# Altium project SPEC_A7.PrjPcb (part 4 of 7)

## Sheet USB_Serial_Quad.SchDoc: SPEC-A7
size 420 x 297 mm; Author: G.Kasprowicz; CompanyName: WUT ISE; DrawnBy: G.Kasprowicz; Organization: WUT ISE; Address1: PW ISE; Address2: Nowowiejska 15/19 00-665 Warsaw; Address3: gkasprow@gmail.com; Revision: 2; SheetNumber: 15; SheetTotal: 18; ModifiedBy: -; CheckedDate: -; Title2: USB IFC; DivGrp: WUT ISE; Designer: G.Kasprowicz; ModifiedDate: -; ProjectName: Sensor Box
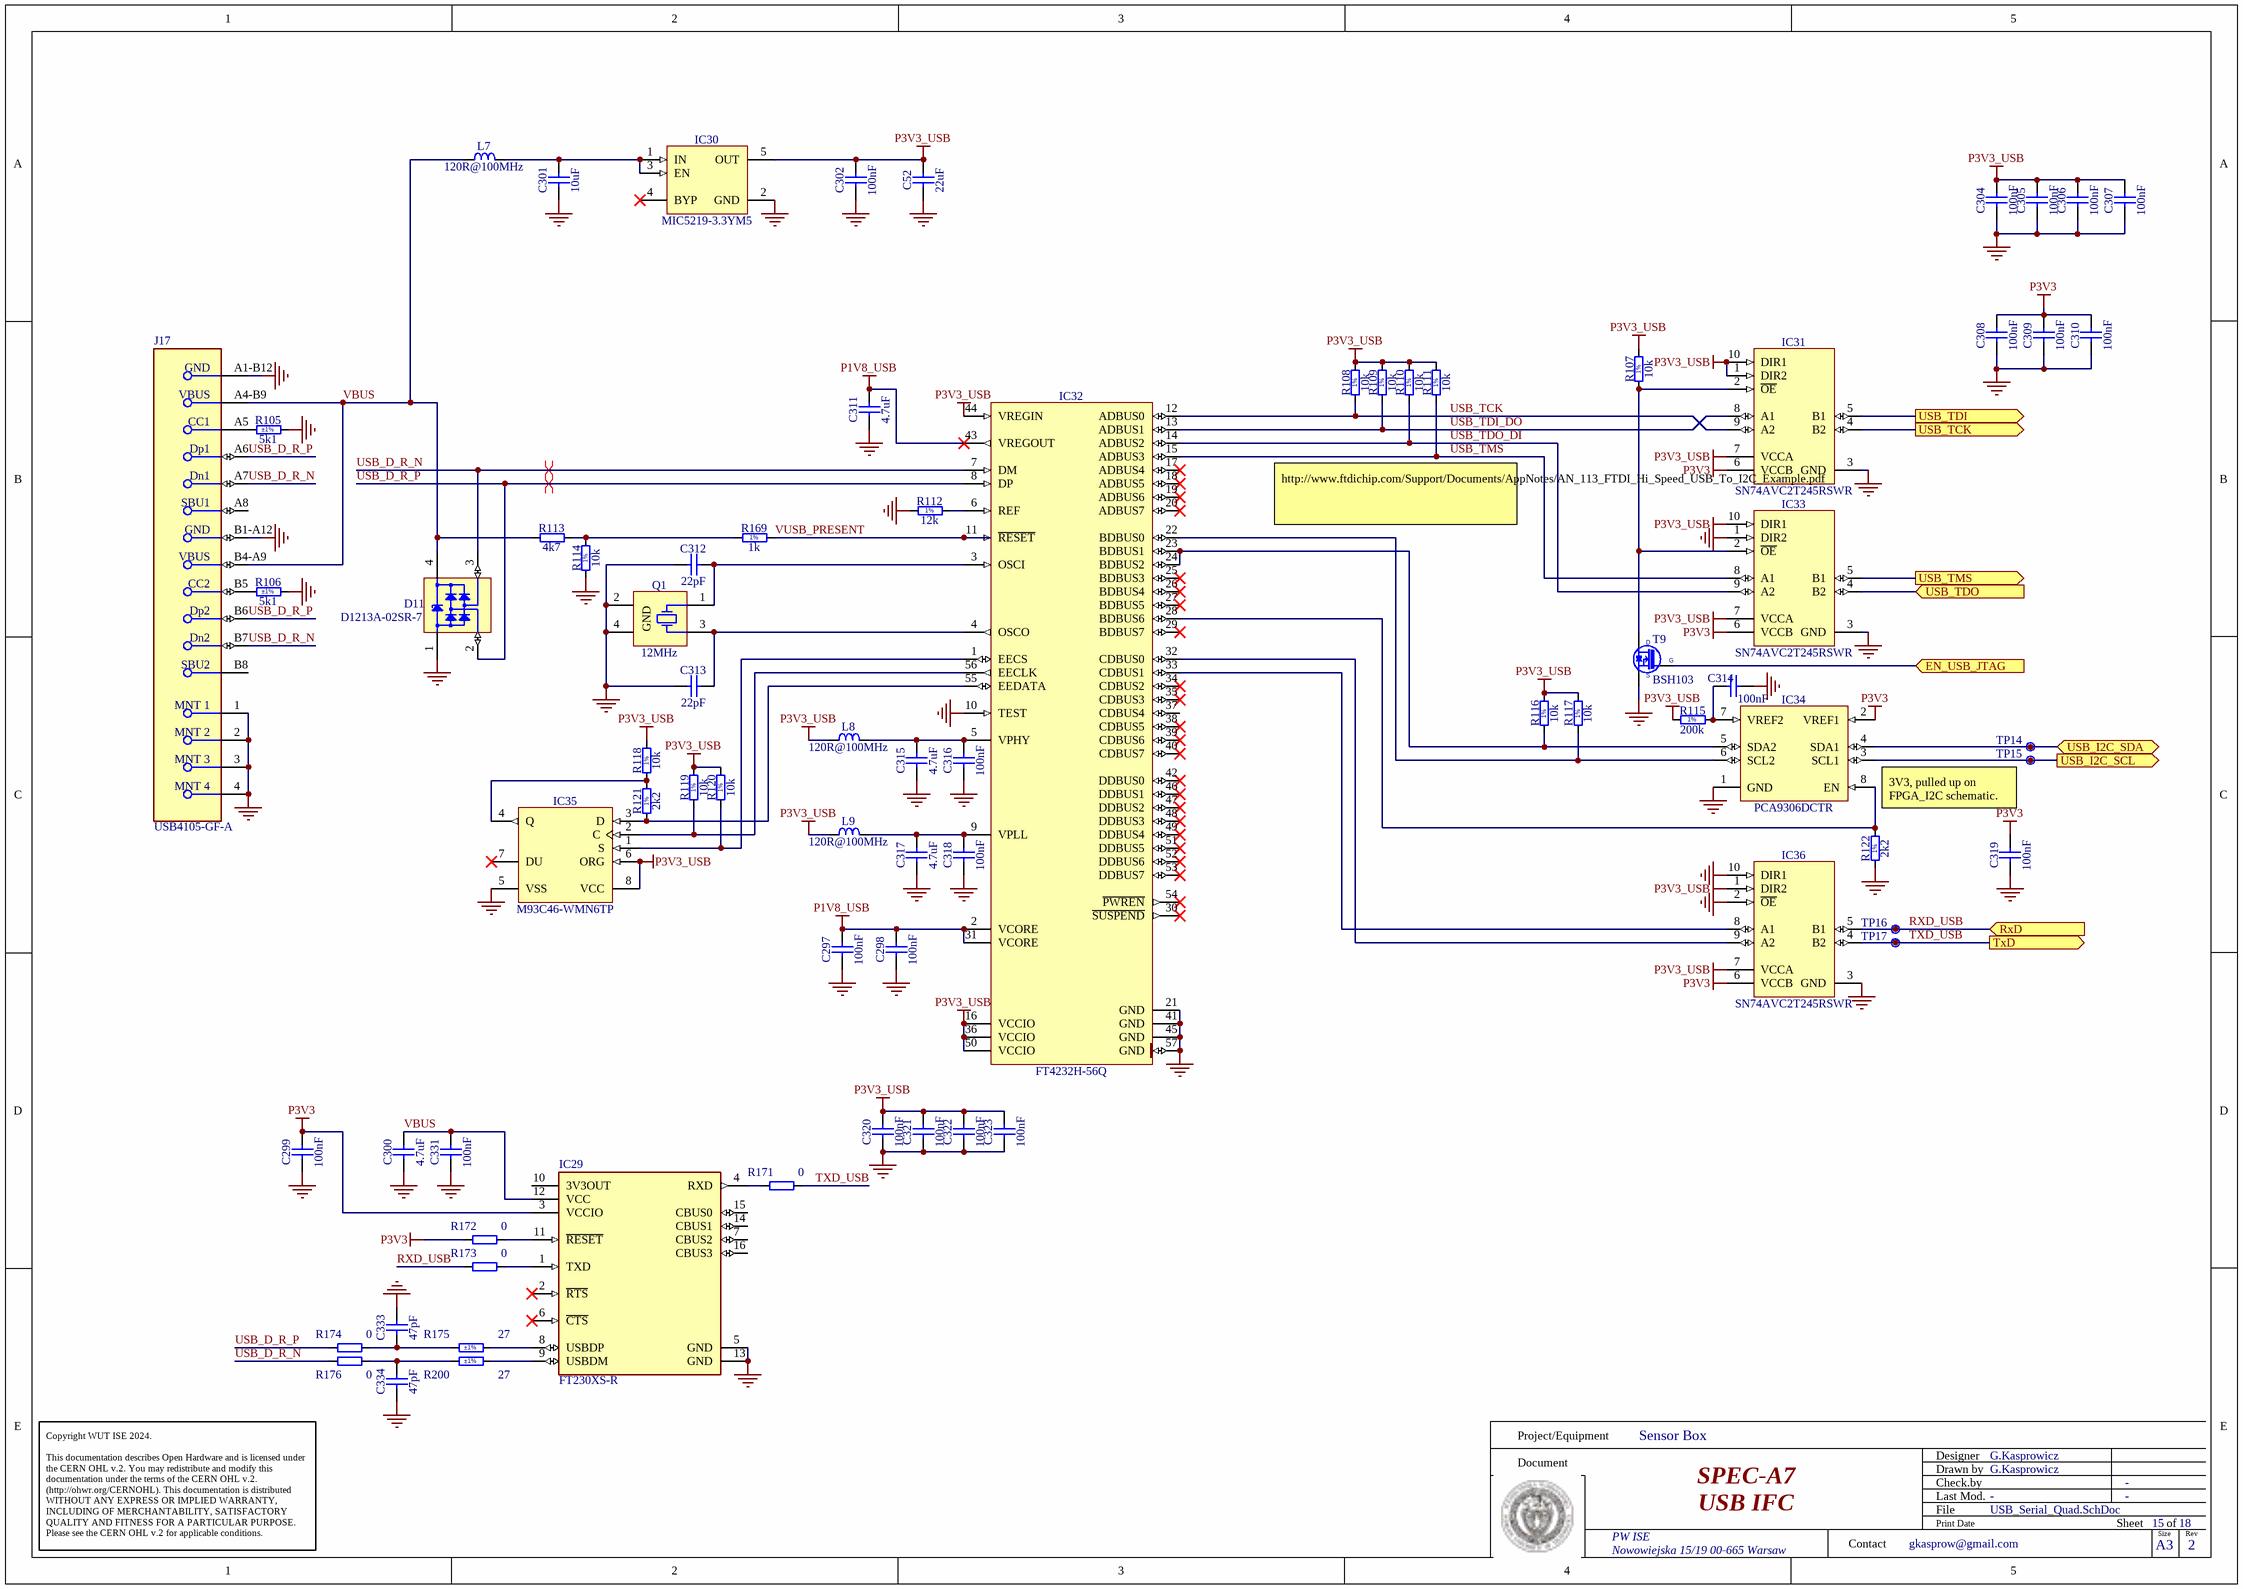
[diagram p8: USB_Serial_Quad.SchDoc]

### Parts
C52  22uF  [CAPC2012X135N]
C297  100nF  [CAPC0603X33N]
C298  100nF  [CAPC0603X33N]
C299  100nF  [CAPC0603X33N]
C300  4.7uF  [CAPC1005X55N]
C301  10uF  [CAPC1608X80N]
C302  100nF  [CAPC0603X33N]
C304  100nF  [CAPC0603X33N]
C305  100nF  [CAPC0603X33N]
C306  100nF  [CAPC0603X33N]
C307  100nF  [CAPC0603X33N]
C308  100nF  [CAPC0603X33N]
C309  100nF  [CAPC0603X33N]
C310  100nF  [CAPC0603X33N]
C311  4.7uF  [CAPC1005X55N]
C312  22pF  [CAPC1005X55N]
C313  22pF  [CAPC1005X55N]
C314  100nF  [CAPC0603X33N]
C315  4.7uF  [CAPC1005X55N]
C316  100nF  [CAPC0603X33N]
C317  4.7uF  [CAPC1005X55N]
C318  100nF  [CAPC0603X33N]
C319  100nF  [CAPC0603X33N]
C320  100nF  [CAPC0603X33N]
C321  100nF  [CAPC0603X33N]
C322  100nF  [CAPC0603X33N]
C323  100nF  [CAPC0603X33N]
C331  100nF  [CAPC0603X33N]
C333  47pF  [CAPC1005X55N]
C334  47pF  [CAPC1005X55N]
D11  D1213A-02SR-7  [SOT190P238X100-4N]
IC29  FT230XS-R  [FP-SSOP-16-MFG]
IC30  MIC5219-3.3YM5  [SOT95P280X145-5N]
IC31  SN74AVC2T245RSWR  [QFN40P140X180X55-10N]
IC32  FT4232H-56Q  [QFN50P800X800X100-57N-S620]
IC33  SN74AVC2T245RSWR  [QFN40P140X180X55-10N]
IC34  PCA9306DCTR  [SOP65P400X130-8N]
IC35  M93C46-WMN6TP  [SOIC127P600X175-8N]
IC36  SN74AVC2T245RSWR  [QFN40P140X180X55-10N]
J17  USB4105-GF-A  [FP-USB4105-GF-A-MFG]
L7  120R@100MHz  [INDC1608X65N]
L8  120R@100MHz  [INDC1608X65N]
L9  120R@100MHz  [INDC1608X65N]
Q1  12MHz  [XTAL_TXC_7M]
R105  5k1  Tolerance: ±1%  [RESC1005X40N]
R106  5k1  Tolerance: ±1%  [RESC1005X40N]
R107  10k  [RESC1005X40N]
R108  10k  [RESC1005X40N]
R109  10k  [RESC1005X40N]
R110  10k  [RESC1005X40N]
R111  10k  [RESC1005X40N]
R112  12k  [RESC1005X40N]
R113  4k7  [RESC1005X40N]
R114  10k  [RESC1005X40N]
R115  200k  [RESC1005X40N]
R116  10k  [RESC1005X40N]
R117  10k  [RESC1005X40N]
R118  10k  [RESC1005X40N]
R119  10k  [RESC1005X40N]
R120  10k  [RESC1005X40N]
R121  2k2  [RESC1005X40N]
R122  2k2  [RESC1005X40N]
R169  1k  [RESC1005X40N]
R171  0  [RESC1005X40N]
R172  0  [RESC1005X40N]
R173  0  [RESC1005X40N]
R174  0  [RESC1005X40N]
R175  27  Tolerance: ±1%  [RESC1005X40N]
R176  0  [RESC1005X40N]
R200  27  Tolerance: ±1%  [RESC1005X40N]
T9  BSH103  [SOT95P230X110-3N]
TP14  Test Point  [TPS127]  (value not drawn)  (no BOM)
TP15  Test Point  [TPS127]  (value not drawn)  (no BOM)
TP16  Test Point  [TPS127]  (value not drawn)  (no BOM)
TP17  Test Point  [TPS127]  (value not drawn)  (no BOM)

### Ports
EN_USB_JTAG (in, see SPEC-A7-TOP[2D], FPGA_PWR_CONFIG[2E]), RxD (in, see SPEC-A7-TOP[2D]), TxD (out, see SPEC-A7-TOP[2D]), USB_I2C_SCL (out, see SPEC-A7-TOP[2D]), USB_I2C_SDA (bidir, see SPEC-A7-TOP[2D]), USB_TCK (out, see SPEC-A7-TOP[2D]), USB_TDI (out, see SPEC-A7-TOP[2D]), USB_TDO (in, see SPEC-A7-TOP[2D]), USB_TMS (out, see SPEC-A7-TOP[2D])

### Nets
GND: C52.1 C297.1 C298.1 C299.1 C300.1 C301.1 C302.1 C304.1 C305.1 C306.1 C307.1 C308.1 C309.1 C310.1 C311.1 C312.1 C313.1 C314.2 C315.1 C316.1 C317.1 C318.1 C319.1 C320.1 C321.1 C322.1 C323.1 C331.1 C333.2 C334.1 D11.1(GND) IC29.5(GND) IC29.13(GND) IC30.2(GND) IC31.3(GND) IC32.10(TEST) IC32.21(GND) IC32.41(GND) IC32.45(GND) IC32.57(GND) IC33.1(DIR2) IC33.3(GND) IC34.1(GND) IC35.5(VSS) IC36.2(~{OE}) IC36.3(GND) IC36.10(DIR1) J17.1(MNT_1) J17.2(MNT_2) J17.3(MNT_3) J17.4(MNT_4) J17.A1-B12(GND) J17.B1-A12(GND) Q1.2(GND) Q1.4(GND) R105.2 R106.2 R112.1 R114.1 R122.1 T9.2(S)
P1V8_USB: C297.2 C298.2 C311.2 IC32.2(VCORE) IC32.31(VCORE) IC32.43(VREGOUT)
P3V3: C299.2 C308.2 C309.2 C310.2 C319.2 IC29.3(VCCIO) IC31.6(VCCB) IC33.6(VCCB) IC34.2(VREF1) IC36.6(VCCB) R172.1
P3V3_USB: C52.2 C302.2 C304.2 C305.2 C306.2 C307.2 C320.2 C321.2 C322.2 C323.2 IC30.5(OUT) IC31.1(DIR2) IC31.7(VCCA) IC31.10(DIR1) IC32.16(VCCIO) IC32.36(VCCIO) IC32.44(VREGIN) IC32.50(VCCIO) IC33.7(VCCA) IC33.10(DIR1) IC35.6(ORG) IC35.8(VCC) IC36.1(DIR2) IC36.7(VCCA) L8.1 L9.1 R107.2 R108.2 R109.2 R110.2 R111.2 R115.1 R116.2 R117.2 R118.2 R119.2 R120.2
CFG_TCK: IC31.4(B2) ; port USB_TCK
CFG_TDI: IC31.5(B1) ; port USB_TDI
CFG_TDO: IC33.4(B2) ; port USB_TDO
CFG_TMS: IC33.5(B1) ; port USB_TMS
RXD_USB: IC36.5(B1) R173.1 TP16.1 ; port RxD
TXD_USB: IC36.4(B2) R171.2 TP17.1 ; port TxD
USB_D_R_N: D11.3(I/O2) IC32.7(DM) J17.A7(Dn1) J17.B7(Dn2) R176.1
USB_D_R_P: D11.2(I/O1) IC32.8(DP) J17.A6(Dp1) J17.B6(Dp2) R174.1
USB_TCK: IC31.9(A2) IC32.12(ADBUS0) R108.1
USB_TDI_DO: IC31.8(A1) IC32.13(ADBUS1) R109.1
USB_TDO_DI: IC32.14(ADBUS2) IC33.9(A2) R110.1
USB_TMS: IC32.15(ADBUS3) IC33.8(A1) R111.1
VBUS: C300.2 C331.2 D11.4(VCC) IC29.12(VCC) J17.A4-B9(VBUS) J17.B4-A9(VBUS) L7.1 R113.1
VUSB_PRESENT: IC32.11(~{RESET}) R169.2
NetC134_2: T9.1(G) ; port EN_USB_JTAG
NetC301_2: C301.2 IC30.1(IN) IC30.3(EN) L7.2
NetC312_2: C312.2 IC32.3(OSCI) Q1.1(X)
NetC313_2: C313.2 IC32.4(OSCO) Q1.3(X)
NetC314_1: C314.1 IC34.7(VREF2) R115.2
NetC315_2: C315.2 C316.2 IC32.5(VPHY) L8.2
NetC317_2: C317.2 C318.2 IC32.9(VPLL) L9.2
NetC333_1: C333.1 R174.2 R175.1
NetC334_2: C334.2 R176.2 R200.1
NetIC29_1: IC29.1(TXD) R173.2
NetIC29_4: IC29.4(RXD) R171.1
NetIC29_8: IC29.8(USBDP) R175.2
NetIC29_9: IC29.9(USBDM) R200.2
NetIC29_11: IC29.11(~{RESET}) R172.2
NetIC31_2: IC31.2(~{OE}) IC33.2(~{OE}) R107.1 T9.3(D)
NetIC32_1: IC32.1(EECS) IC35.1(S) R120.1
NetIC32_6: IC32.6(REF) R112.2
NetIC32_22: IC32.22(BDBUS0) IC34.6(SCL2) R117.1
NetIC32_23: IC32.23(BDBUS1) IC32.24(BDBUS2) IC34.5(SDA2) R116.1
NetIC32_28: IC32.28(BDBUS6) IC34.8(EN) R122.2
NetIC32_32: IC32.32(CDBUS0) IC36.9(A2)
NetIC32_33: IC32.33(CDBUS1) IC36.8(A1)
NetIC32_55: IC32.55(EEDATA) IC35.3(D) R121.2
NetIC32_56: IC32.56(EECLK) IC35.2(C) R119.1
NetIC34_3: IC34.3(SCL1) TP15.1 ; port USB_I2C_SCL
NetIC34_4: IC34.4(SDA1) TP14.1 ; port USB_I2C_SDA
NetIC35_4: IC35.4(Q) R118.1 R121.1
NetJ17_A5: J17.A5(CC1) R105.1
NetJ17_B5: J17.B5(CC2) R106.1
NetR113_2: R113.2 R114.2 R169.1

Not connected (* = marked no-connect by the designer): IC29 2(~{RTS})* 6(~{CTS})* 7(CBUS2) 10(3V3OUT) 14(CBUS1) 15(CBUS0) 16(CBUS3); IC30 4(BYP)*; IC32 17(ADBUS4)* 18(ADBUS5)* 19(ADBUS6)* 20(ADBUS7)* 25(BDBUS3)* 26(BDBUS4)* 27(BDBUS5)* 29(BDBUS7)* 30(~{SUSPEND})* 34(CDBUS2)* 35(CDBUS3)* 37(CDBUS4) 38(CDBUS5)* 39(CDBUS6)* 40(CDBUS7)* 42(DDBUS0)* 46(DDBUS1)* 47(DDBUS2)* 48(DDBUS3)* 49(DDBUS4)* 51(DDBUS5)* 52(DDBUS6)* 53(DDBUS7)* 54(~{PWREN})*; IC35 7(DU)*; J17 A8(SBU1) B8(SBU2)

### Layout directives
differential pair; differential pair class Diff_90Ohm: USB_D_R_N, USB_D_R_P

### Notes on the sheet
- http://www.ftdichip.com/Support/Documents/AppNotes/AN_113_FTDI_Hi_Speed_USB_To_I2C_Example.pdf
- 3V3, pulled up on FPGA_I2C schematic.
- Project/Equipment
- Document
- Designer
- Drawn by
- Check.by
- Copyright WUT ISE 2024.
  This documentation describes Open Hardware and is licensed under the CERN OHL v.2. You may redistribute and modify this documentation under the terms of the CERN OHL v.2. (http://ohwr.org/CERNOHL). This documentation is distributed WITHOUT ANY EXPRESS OR IMPLIED WARRANTY, INCLUDING OF MERCHANTABILITY, SATISFACTORY QUALITY AND FITNESS FOR A PARTICULAR PURPOSE. Please see the CERN OHL v.2 for applicable conditions.
- Contact
- File
- Last Mod.
- Print Date
- Sheet
- Size
- A3
- of
- Rev
- (in symbol R0402_1k_1%_0.0625W_100PPM) 1%
- (in symbol R0402_2K2_1%_0.0625W_100PPM) 1%
- (in symbol R0402_10K_1%_0.0625W_100PPM) 1%
- (in symbol R0402_12K_1%_0.0625W_100PPM) 1%
- (in symbol R0402_200K_1%_0.0625W_100PPM) 1%

### Library data of the parts
C52 = CC0805_22UF_16V_10%_X5R: Non-polarised capacitor; Part Description: SMD Multilayer Chip Ceramic Capacitor; Manufacturer: GENERIC; Manufacturer1 Part Number: C2012X5R1C226KT; Voltage: 16V; TC: X5R; Tolerance: ±10%; Part Number: CC0805_22UF_16V_10%_X5R; Component Kind: Standard; Component Type: Standard; Pin Count: 2; Value: 22uF; Status: Preferred; Manufacturer Part Number: CC0805_22UF_16V_10%_X5R; Case: 0805; Mounted: Yes; Socket: No; SMD: Yes; Sense: No; Manufacturer1 Example: TDK; Manufacturer1 ComponentHeight: 1.35mm; HelpURL: \\cern.ch\dfs\Applications\Altium\Datasheets\CC0805_X5R_TDK_C.pdf; Author: CERN DEM JLC; CreateDate: 25.10.2012; LatestRevisionDate: 25.10.2012
C297-C299 C302 C304-C310 C314 C316 C318-C323 C331 = CC0201_100NF_6.3V_10%_X5R: Non-polarised capacitor; Part Description: SMD Multilayer Chip Ceramic Capacitor; Manufacturer: GENERIC; Manufacturer1 Part Number: 02016D104KAT2A; Voltage: 6.3V; TC: X5R; Tolerance: ±10%; Part Number: CC0201_100NF_6.3V_10%_X5R; Component Kind: Standard; Component Type: Standard; Pin Count: 2; Value: 100nF; Status: Not Recommended; Manufacturer Part Number: CC0201_100NF_6.3V_10%_X5R; Case: 0201; Mounted: Yes; Socket: No; SMD: Yes; Sense: No; Manufacturer1 Example: AVX; Manufacturer1 ComponentHeight: 0.33mm; HelpURL: \\cern.ch\dfs\Applications\Altium\Datasheets\CC0201_X5R_AVX.pdf; Author: CERN DEM JLC; CreateDate: 03.12.2007; LatestRevisionDate: 03.12.2007
C300 C311 C315 C317 = CC0402_4.7UF_6.3V_20%_X5R: Non-polarised capacitor; Part Description: SMD Multilayer Chip Ceramic Capacitor; Manufacturer: GENERIC; Manufacturer1 Part Number: C1005X5R0J475M050; Voltage: 6.3V; TC: X5R; Tolerance: ±20%; Part Number: CC0402_4.7UF_6.3V_20%_X5R; Component Kind: Standard; Component Type: Standard; Pin Count: 2; Value: 4.7uF; Status: Preferred; Manufacturer Part Number: CC0402_4.7UF_6.3V_20%_X5R; Case: 0402; Mounted: Yes; Socket: No; SMD: Yes; Sense: No; Manufacturer1 Example: TDK; Manufacturer1 ComponentHeight: 0.65mm; HelpURL: \\cern.ch\dfs\Applications\Altium\Datasheets\CC0402_X5R_TDK_C.pdf; Author: CERN DEM JLC; CreateDate: 03.03.2015; LatestRevisionDate: 03.03.2015
C301 = CC0603_10UF_16V_20%_X5R: Non-polarised capacitor; Part Description: SMD Multilayer Chip Ceramic Capacitor; Manufacturer: GENERIC; Manufacturer1 Part Number: GRM188R61C106MA73D; Voltage: 16V; TC: X5R; Tolerance: ±20%; Part Number: CC0603_10UF_16V_20%_X5R; Component Kind: Standard; Component Type: Standard; Pin Count: 2; Value: 10uF; Status: None; Manufacturer Part Number: CC0603_10UF_16V_20%_X5R; Case: 0603; Mounted: Yes; Socket: No; SMD: Yes; Sense: No; Manufacturer1 Example: MURATA; Manufacturer1 ComponentHeight: 0.8mm; HelpURL: \\cern.ch\dfs\Applications\Altium\Datasheets\CC0603_X5R_MURATA_GRM.pdf; Author: CERN DEM MR; CreateDate: 02.03.2016; LatestRevisionDate: 02.03.2016
C312 C313 = CC0402_22PF_50V_5%_C0G: Non-polarised capacitor; Part Description: SMD Multilayer Chip Ceramic Capacitor; Manufacturer: GENERIC; Manufacturer1 Part Number: C0402C220J5GACTU; Voltage: 50V; TC: C0G/NP0; Tolerance: ±5%; Part Number: CC0402_22PF_50V_5%_C0G; Component Kind: Standard; Component Type: Standard; Pin Count: 2; Value: 22pF; Status: Preferred; Manufacturer Part Number: CC0402_22PF_50V_5%_C0G; Case: 0402; Mounted: Yes; Socket: No; SMD: Yes; Sense: No; Manufacturer1 Example: KEMET; Manufacturer1 ComponentHeight: 0.55mm; HelpURL: \\cern.ch\dfs\Applications\Altium\Datasheets\CC0805_C0G_KEMET_(Commercial Grade).pdf; Author: CERN DEM JLC; CreateDate: 03.12.2007; LatestRevisionDate: 03.12.2007
C333 C334 = CC0402_47PF_50V_5%_C0G: Non-polarised capacitor; Part Description: SMD Multilayer Chip Ceramic Capacitor; Manufacturer: GENERIC; Manufacturer1 Part Number: C0402C470J5GACTU; Voltage: 50V; TC: C0G/NP0; Tolerance: ±5%; Part Number: CC0402_47PF_50V_5%_C0G; Component Kind: Standard; Component Type: Standard; Pin Count: 2; Value: 47pF; Status: Preferred; Manufacturer Part Number: CC0402_47PF_50V_5%_C0G; Case: 0402; Mounted: Yes; Socket: No; SMD: Yes; Sense: No; Manufacturer1 Example: KEMET; Manufacturer1 ComponentHeight: 0.55mm; HelpURL: \\cern.ch\dfs\Applications\Altium\Datasheets\CC0402_C0G_KEMET_(Commercial Grade).pdf; Author: CERN DEM JLC; CreateDate: 03.12.2007; LatestRevisionDate: 22.04.2015
D11 = CMP-004-00039-1: D1213A-02SR Series 400 mW Uni-Directional Surface Mount TVS Diode - SOT-143; Mounting Technology: Surface Mount; Case/Package: SOT-143; Max Operating Temperature: 150°C; Pins: 4; Min Operating Temperature: -65°C
IC29 = CMP-0248-00026-3: IC USB SERIAL BASIC UART 16SSOP; Min Supply Voltage: 2.97V; Data Rate: 12Mbps; Operating Supply Voltage: 5V; Number of Channels: 1; Max Supply Voltage: 5.5V; Operating Supply Current: 8mA; Case/Package: SSOP; Length: 5mm; Interface: UART; Mount: Surface Mount; Number of Pins: 16; Packaging: Tape and Reel; Weight: 0.004586oz; Min Operating Temperature: -40°C; Width: 0.157inch; Height: 0.059inch; Package Quantity: 3000; Max Operating Temperature: 85°C
IC30 = MIC5219-3.3YM5: 500mA Peak Output LDO Regulator; Part Description: 3.3V 500mA Peak Output Low Drop-Out  (LDO) Regulator; Manufacturer: MICROCHIP TECHNOLOGY; PressFit: No; Bonding: No; Part Number: MIC5219-3.3YM5; Component Kind: Standard; Component Type: Standard; Device: MIC5219-3.3YM5; PackageDescription: SOT, 0.95mm pitch; 5 pin, 1.60mm W X 2.90mm L X 1.45mm H body, IPC Medium Density; Manufacturer Part Number: MIC5219-3.3YM5; Pin Count: 5; Case: SOT23-5; Mounted: Yes; Socket: No; SMD: Yes; Sense: No; ComponentHeight: 1.45mm; HelpURL: \\cern.ch\dfs\Applications\Altium\Datasheets\MIC5219-3.3YM5.pdf; Author: CERN DEM WB; CreateDate: 2019-04-16; LatestRevisionDate: 2019-04-16
IC31 IC33 IC36 = SN74AVC2T245RSWR: Dual-Bit Dual-Supply Bus Transceiver With Configurable Voltage Translation and 3-State Outputs; Manufacturer: TEXAS INSTRUMENTS; PressFit: No; Bonding: No; Part Number: SN74AVC2T245RSWR; Component Kind: Standard; Component Type: Standard; Device: SN74AVC2T245RSWR; PackageDescription: QFN, 0.40mm Pitch, Rect.;10 Pin, 1.80mm L X 1.40mm W X 0.55mm H Body, IPC Medium Density; Status: Not Recommended; Part Description: Dual-Bit Dual-Supply Bus Transceiver With Configurable Voltage Translation and 3-State Outputs; Manufacturer Part Number: SN74AVC2T245RSWR; Pin Count: 10; Case: QFN10; Mounted: Yes; Socket: No; SMD: Yes; Sense: No; ComponentHeight: 0.55mm; Author: CERN DEM JLC; HelpURL: \\cern.ch\dfs\Applications\Altium\Datasheets\SN74AVC2T245RSWR.pdf; CreateDate: 07.07.2014; LatestRevisionDate: 30.03.2017
IC32 = FT4232H-56Q: Quad High Speed USB to Multipurpose UART/MPSSE IC; Manufacturer: FUTURE TECHNOLOGY DEVICES INTERNATIONAL (FTDI); PressFit: No; Bonding: No; Part Number: FT4232H-56Q; Component Kind: Standard; Component Type: Standard; Device: FT4232H-56Q; PackageDescription: QFN, 0.50mm Pitch, Square; 56 Pin, 8.00mm L X 8.00mm W X 1.00mm H body (6.1mm X 6.1mm Thermal tab), IPC Medium Density; Part Description: Quad High Speed USB to Multipurpose UART/MPSSE IC; Manufacturer Part Number: FT4232H-56Q; Pin Count: 57; Case: QFN56; Mounted: Yes; Socket: No; SMD: Yes; Sense: No; ComponentHeight: 1mm; Author: CERN DEM JLC; HelpURL: \\cern.ch\dfs\Applications\Altium\Datasheets\FT4232H-56Q.pdf; CreateDate: 11.10.2016; LatestRevisionDate: 11.10.2016
IC34 = PCA9306DCTR: Dual Bidirectional I2C Bus And SMBus Voltage-Level Translator; Manufacturer: TEXAS INSTRUMENTS; PressFit: No; Bonding: No; Part Number: PCA9306DCTR; Component Kind: Standard; Component Type: Standard; Device: PCA9306DCTR; PackageDescription: SOP, 0.65mm, Pitch; 8 Pin, 2.80mm W X 2.95mm L X 1.30mm H Body, PC Medium Density; Part Description: Dual Bidirectional I2C Bus And SMBus Voltage-Level Translator; Manufacturer Part Number: PCA9306DCTR; Pin Count: 8; Case: SSOP8; Mounted: Yes; Socket: No; SMD: Yes; Sense: No; ComponentHeight: 1.3mm; Author: CERN DEM JLC; HelpURL: \\cern.ch\dfs\Applications\Altium\Datasheets\PCA9306DCTR.pdf; CreateDate: 25.02.2013; LatestRevisionDate: 11.02.2016
IC35 = M93C46-WMN6TP: 2.5 to 5.5 V, 1Kb (128x8) Serial Microwire Bus EEPROM; Part Description: 1Kbit (128 x 8 bit or 64 x 16 bit) MICROWIRE® Serial Access EEPROM; Manufacturer: ST MICROELECTRONICS; PressFit: No; Bonding: No; Part Number: M93C46-WMN6TP; Component Kind: Standard; Component Type: Standard; Device: M93C46-WMN6TP; PackageDescription: SOIC 8, Pitch 1.27mm - Body 4x5mm, IPC Medium Density; Manufacturer Part Number: M93C46-WMN6TP; Pin Count: 8; Case: SOIC8; Mounted: Yes; Socket: No; SMD: Yes; Sense: No; ComponentHeight: 1.75mm; HelpURL: \\cern.ch\dfs\Applications\Altium\Datasheets\M93C46-WMN6TP.pdf; Author: CERN DEM JLC; CreateDate: 15.11.2012; LatestRevisionDate: 15.11.2012
J17 = CMP-245163-000001-1: CONN RCPT USB2.0 TYPEC 5A; Manufacturer: GCT; Voltage Rating: 20V; Is Female: yes; Current Rating: 5/6.25/1.25/0.25A; Number Of Contacts: 16; Conn Orientation: Right Angle; Device Class L1: Connectors; Category: Conn; Lead Free: Yes; RoHS: TRUE; Temperature Range High: +85°C; Digikey Description: CONN RCPT USB2.0 TYPEC 5A; Device Class L3: unset; ComponentLink2Description: Datasheet; Manufacturer Part Number: USB4105-GF-A; Package: 0; Usb Standard: USB 2.0; Device Class L2: USB Connectors; Automotive: No; Temperature Range Low: -40°C; Height: 3.46mm; Temperature: -40°C to +85°C; Contact Material: Gold,Nickel; ComponentLink2URL: https://gct.co/files/drawings/usb4105.pdf; Octopart: https://octopart.com/usb4105-gf-a-gct-106627878
L7-L9 = IND0603_MURATA_BLM18SG121TN1D: Inductor; Part Description: SMD EMIFIL Suppression Chip Ferrite Bead; Manufacturer: MURATA; Power: 3A; Resistance: 0.025R; Tolerance: ±25%; Part Number: IND0603_MURATA_BLM18SG121TN1D; Component Kind: Standard; Component Type: Standard; Pin Count: 2; Value: 120R@100MHz; Status: None; Manufacturer Part Number: BLM18SG121TN1D; Case: 0603; Mounted: Yes; Socket: No; SMD: Yes; Sense: No; ComponentHeight: 0.65mm; HelpURL: \\cern.ch\dfs\Applications\Altium\Datasheets\IND0603_MURATA_BLM18S.pdf; Author: CERN DEM JLC; CreateDate: 23.07.2014; LatestRevisionDate: 23.07.2014
Q1 = XTAL_12MHZ_TXC_7M-12.000MAAJ-T: Crystal 4 pins 1=XTAL Control 2=GND3=XTAL 4=GND; Part Description: ±30ppm 18pF -20°C to +70°C  4 Pins, 3.2x2.5X0.8mm, SMD Sealing Crystal, 7M Series; Manufacturer: TXC CORPORATION; PressFit: No; Bonding: No; Part Number: XTAL_12MHZ_TXC_7M-12.000MAAJ-T; Component Kind: Standard; Component Type: Standard; PackageDescription: 4 Pins, 2.5x3.2mm, SMD Sealing Crystal, 7M Serie; Value: 12MHz; Manufacturer Part Number: 7M-12.000MAAJ-T; Pin Count: 4; Mounted: Yes; Socket: No; SMD: Yes; Sense: No; ComponentHeight: 0.8mm; HelpURL: \\cern.ch\dfs\Applications\Altium\Datasheets\XTAL_TXC_7M.pdf; Author: CERN DEM JLC; CreateDate: 19.06.2012; LatestRevisionDate: 19.06.2012
R105 R106 = R0402_5K1_1%_0.0625W_100PPM: Resistor - 1%; Part Description: General Purpose Thick Film Chip Resistor; Manufacturer: GENERIC; Manufacturer1 Part Number: 232270675102L; TC: ±100ppm/°C; PressFit: No; Part Number: R0402_5K1_1%_0.0625W_100PPM; Component Kind: Standard; Component Type: Standard; Pin Count: 2; Value: 5k1; Status: Not Recommended; Power: 0.0625W; Manufacturer Part Number: R0402_5K1_1%_0.0625W_100PPM; Case: 0402; Mounted: Yes; Sense: No; Socket: No; SMD: Yes; Manufacturer1 Example: YAGEO PHYCOMP; Manufacturer1 ComponentHeight: 0.4mm; HelpURL: \\cern.ch\dfs\Applications\Altium\Datasheets\R0402_Phycomp_RC0402.pdf; Author: CERN DEM JLC; CreateDate: 03.12.2007; LatestRevisionDate: 17.10.2012
R107-R111 R114 R116-R120 = R0402_10K_1%_0.0625W_100PPM: Resistor - 1%; Part Description: General Purpose Thick Film Chip Resistor; Manufacturer: GENERIC; Manufacturer1 Part Number: 232270671003L; TC: ±100ppm/°C; PressFit: No; Part Number: R0402_10K_1%_0.0625W_100PPM; Component Kind: Standard; Component Type: Standard; Pin Count: 2; Value: 10k; Status: Not Recommended; Power: 0.0625W; Tolerance: ±1%; Manufacturer Part Number: R0402_10K_1%_0.0625W_100PPM; Case: 0402; Mounted: Yes; Socket: No; SMD: Yes; Manufacturer1 Example: YAGEO PHYCOMP; Manufacturer1 ComponentHeight: 0.4mm; HelpURL: \\cern.ch\dfs\Applications\Altium\Datasheets\R0402_Phycomp_RC0402.pdf; Author: CERN DEM JLC; CreateDate: 03.12.2007; LatestRevisionDate: 17.10.2012; Sense: No
R112 = R0402_12K_1%_0.0625W_100PPM: Resistor - 1%; Part Description: General Purpose Thick Film Chip Resistor; Manufacturer: GENERIC; Manufacturer1 Part Number: 232270671203L; TC: ±100ppm/°C; PressFit: No; Part Number: R0402_12K_1%_0.0625W_100PPM; Component Kind: Standard; Component Type: Standard; Pin Count: 2; Value: 12k; Status: Not Recommended; Power: 0.0625W; Tolerance: ±1%; Manufacturer Part Number: R0402_12K_1%_0.0625W_100PPM; Case: 0402; Mounted: Yes; Sense: No; Socket: No; SMD: Yes; Manufacturer1 Example: YAGEO PHYCOMP; Manufacturer1 ComponentHeight: 0.4mm; HelpURL: \\cern.ch\dfs\Applications\Altium\Datasheets\R0402_Phycomp_RC0402.pdf; Author: CERN DEM JLC; CreateDate: 03.12.2007; LatestRevisionDate: 17.10.2012
R113 = R0402_4K7_1%_0.0625W_100PPM: Resistor - 1%; Part Description: General Purpose Thick Film Chip Resistor; Manufacturer: GENERIC; Manufacturer1 Part Number: 232270674702L; TC: ±100ppm/°C; PressFit: No; Part Number: R0402_4K7_1%_0.0625W_100PPM; Component Kind: Standard; Component Type: Standard; Pin Count: 2; Value: 4k7; Status: Not Recommended; Power: 0.0625W; Tolerance: ±1%; Manufacturer Part Number: R0402_4K7_1%_0.0625W_100PPM; Case: 0402; Mounted: Yes; Sense: No; Socket: No; SMD: Yes; Manufacturer1 Example: YAGEO PHYCOMP; Manufacturer1 ComponentHeight: 0.4mm; HelpURL: \\cern.ch\dfs\Applications\Altium\Datasheets\R0402_Phycomp_RC0402.pdf; Author: CERN DEM JLC; CreateDate: 03.12.2007; LatestRevisionDate: 17.10.2012
R115 = R0402_200K_1%_0.0625W_100PPM: Resistor - 1%; Part Description: General Purpose Thick Film Chip Resistor; Manufacturer: GENERIC; Manufacturer1 Part Number: 232270672004L; TC: ±100ppm/°C; PressFit: No; Part Number: R0402_200K_1%_0.0625W_100PPM; Component Kind: Standard; Component Type: Standard; Pin Count: 2; Value: 200k; Status: Not Recommended; Power: 0.0625W; Tolerance: ±1%; Manufacturer Part Number: R0402_200K_1%_0.0625W_100PPM; Case: 0402; Mounted: Yes; Sense: No; Socket: No; SMD: Yes; Manufacturer1 Example: YAGEO PHYCOMP; Manufacturer1 ComponentHeight: 0.4mm; HelpURL: \\cern.ch\dfs\Applications\Altium\Datasheets\R0402_Phycomp_RC0402.pdf; Author: CERN DEM JLC; CreateDate: 03.12.2007; LatestRevisionDate: 17.10.2012
R121 R122 = R0402_2K2_1%_0.0625W_100PPM: Resistor - 1%; Part Description: General Purpose Thick Film Chip Resistor; Manufacturer: GENERIC; Manufacturer1 Part Number: 232270672202L; TC: ±100ppm/°C; PressFit: No; Part Number: R0402_2K2_1%_0.0625W_100PPM; Component Kind: Standard; Component Type: Standard; Pin Count: 2; Value: 2k2; Status: Not Recommended; Power: 0.0625W; Tolerance: ±1%; Manufacturer Part Number: R0402_2K2_1%_0.0625W_100PPM; Case: 0402; Mounted: Yes; Sense: No; Socket: No; SMD: Yes; Manufacturer1 Example: YAGEO PHYCOMP; Manufacturer1 ComponentHeight: 0.4mm; HelpURL: \\cern.ch\dfs\Applications\Altium\Datasheets\R0402_Phycomp_RC0402.pdf; Author: CERN DEM JLC; CreateDate: 03.12.2007; LatestRevisionDate: 17.10.2012
R169 = R0402_1k_1%_0.0625W_100PPM: Resistor - 1%; Part Description: General Purpose Thick Film Chip Resistor; Manufacturer: GENERIC; Manufacturer1 Part Number: 232270671002L; TC: ±100ppm/°C; PressFit: No; Part Number: R0402_1K_1%_0.0625W_100PPM; Component Kind: Standard; Component Type: Standard; Pin Count: 2; Value: 1k; Status: Not Recommended; Power: 0.0625W; Tolerance: ±1%; Manufacturer Part Number: R0402_1K_1%_0.0625W_100PPM; Case: 0402; Mounted: Yes; Sense: No; Socket: No; SMD: Yes; Manufacturer1 Example: YAGEO PHYCOMP; Manufacturer1 ComponentHeight: 0.4mm; HelpURL: \\cern.ch\dfs\Applications\Altium\Datasheets\R0402_Phycomp_RC0402.pdf; Author: CERN DEM JLC; CreateDate: 03.12.2007; LatestRevisionDate: 17.10.2012
R171-R174 R176 = R0402_0R_JUMPER: as R137-R144 on sheet DIFF_DELAY_FANOUT; Part Number: R0402_0R_JUMPER; Component Kind: Standard; Component Type: Standard; Pin Count: 2; Value: 0; Status: Not Recommended; Manufacturer Part Number: R0402_0R_JUMPER; Case: 0402; Mounted: Yes; Sense: No; Socket: No; SMD: Yes; Manufacturer1 Example: YAGEO PHYCOMP; Manufacturer1 ComponentHeight: 0.4mm; HelpURL: \\cern.ch\dfs\Applications\Altium\Datasheets\R0402_Phycomp_RC0402.pdf; Author: CERN DEM JLC; CreateDate: 03.12.2007; LatestRevisionDate: 17.10.2012; ClassName: Artix
R175 R200 = R0402_27R_1%_0.0625W_100PPM: Resistor - 1%; Part Description: General Purpose Thick Film Chip Resistor; Manufacturer: GENERIC; Manufacturer1 Part Number: 232270672709L; TC: ±100ppm/°C; PressFit: No; Part Number: R0402_27R_1%_0.0625W_100PPM; Component Kind: Standard; Component Type: Standard; Pin Count: 2; Value: 27; Status: Not Recommended; Power: 0.0625W; Manufacturer Part Number: R0402_27R_1%_0.0625W_100PPM; Case: 0402; Mounted: Yes; Sense: No; Socket: No; SMD: Yes; Manufacturer1 Example: YAGEO PHYCOMP; Manufacturer1 ComponentHeight: 0.4mm; HelpURL: \\cern.ch\dfs\Applications\Altium\Datasheets\R0402_Phycomp_RC0402.pdf; Author: CERN DEM JLC; CreateDate: 03.12.2007; LatestRevisionDate: 17.10.2012
T9 = BSH103: N-CHANNEL MOSFET WITH DIODE; Part Description: 30V 850mA N-Channel Enhancement Mode Field-Effect Transistor; Manufacturer: NEXPERIA; PressFit: No; Bonding: No; Part Number: BSH103; Component Kind: Standard; Component Type: Standard; Device: BSH103; PackageDescription: SOT23, 3 pin, Pitch 0.95mm - 1.3mm W X 2.9mm L X 1.1mm H, IPC Medium Density; Manufacturer Part Number: BSH103; Pin Count: 3; Case: SOT23-3; Mounted: Yes; Socket: No; SMD: Yes; Sense: No; ComponentHeight: 1.1mm; HelpURL: \\cern.ch\dfs\Applications\Altium\Datasheets\BSH103.pdf; Author: CERN DEM JLC; CreateDate: 16.03.2010; LatestRevisionDate: 20.06.2017
TP14-TP17 = SMD_PAD_1.27X1.27MM: Part Description: 1.27mm x 1.27mm PCB Copper Area (SMD Test Point); Mounted: No; Part Number: SMD_PAD_1.27X1.27MM; Component Type: Standard (No BOM); Pin Count: 1; Family: Test Point; Socket: No; SMD: Yes; Sense: No; Status: None; ComponentHeight: 0mm; HelpURL: Undefined; Author: CERN DEM JLC; CreateDate: 12.01.2008; LatestRevisionDate: 12.01.2008; PackageDescription: 1.27mm x 1.27mm PCB Copper Area (SMD Test Point)

## Sheet XO_125M.SchDoc: SPEC-A7
size 420 x 297 mm; Author: G.Kasprowicz; CompanyName: WUT ISE; DrawnBy: G.Kasprowicz; Organization: WUT ISE; Address1: PW ISE; Address2: Nowowiejska 15/19 00-665 Warsaw; Address3: gkasprow@gmail.com; Revision: 2; SheetNumber: 9; SheetTotal: 18; ModifiedBy: -; CheckedDate: -; Title2: 125M VCXO; DivGrp: WUT ISE; Designer: G.Kasprowicz; ModifiedDate: -; ProjectName: Sensor Box
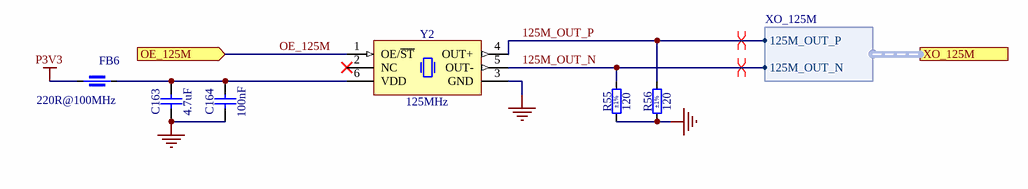
[diagram p9: XO_125M.SchDoc]

### Parts
C163  4.7uF  [CAPC1005X55N]
C164  100nF  [CAPC0603X33N]
FB6  220R@100MHz  [INDC1608X95N]
R55  120  Tolerance: ±1%  [RESC1005X40N]
R56  120  Tolerance: ±1%  [RESC1005X40N]
Y2  125MHz  [OSC_SI-TIME_SIT9121-C]

### Ports
OE_125M (in, see SPEC-A7-TOP[3C], FPGA_14_15[4C]), XO_125M (harness XO_125M, see SPEC-A7-TOP[3C], FPGA_MGT[1D])

### Harnesses
XO_125M: 125M_OUT_P, 125M_OUT_N

### Nets
GND: C163.1 C164.1 R55.1 R56.1 Y2.3(GND)
P3V3: FB6.1
125M_OUT_N: R55.2 Y2.5(OUT-) ; port XO_125M.125M_OUT_N  [project net 125M_CLK_N]
125M_OUT_P: R56.2 Y2.4(OUT+) ; port XO_125M.125M_OUT_P  [project net 125M_CLK_P]
OE_125M: Y2.1(OE/~{ST}) ; port OE_125M
NetC163_2: C163.2 C164.2 FB6.2 Y2.6(VDD)

Not connected (* = marked no-connect by the designer): Y2 2(NC)*

### Layout directives
differential pair: 125M_CLK_N, 125M_CLK_P

### Notes on the sheet
- Project/Equipment
- Document
- Designer
- Drawn by
- Check.by
- Copyright WUT ISE 2024.
  This documentation describes Open Hardware and is licensed under the CERN OHL v.2. You may redistribute and modify this documentation under the terms of the CERN OHL v.2. (http://ohwr.org/CERNOHL). This documentation is distributed WITHOUT ANY EXPRESS OR IMPLIED WARRANTY, INCLUDING OF MERCHANTABILITY, SATISFACTORY QUALITY AND FITNESS FOR A PARTICULAR PURPOSE. Please see the CERN OHL v.2 for applicable conditions.
- Contact
- File
- Last Mod.
- Print Date
- Sheet
- Size
- A3
- of
- Rev

### Library data of the parts
C163 = CC0402_4.7UF_6.3V_20%_X5R: Non-polarised capacitor; Part Description: SMD Multilayer Chip Ceramic Capacitor; Manufacturer: GENERIC; Manufacturer1 Part Number: C1005X5R0J475M050BC; Voltage: 6.3V; TC: X5R; Tolerance: ±20%; Part Number: CC0402_4.7UF_6.3V_20%_X5R; Component Kind: Standard; Component Type: Standard; Pin Count: 2; Value: 4.7uF; Status: Preferred; Manufacturer Part Number: CC0402_4.7UF_6.3V_20%_X5R; Case: 0402; Mounted: Yes; Socket: No; SMD: Yes; Sense: No; Manufacturer1 Example: TDK; Manufacturer1 ComponentHeight: 0.65mm; HelpURL: \\cern.ch\dfs\Applications\Altium\Datasheets\CC0402_X5R_TDK_C.pdf; Author: CERN DEM JLC; CreateDate: 03.03.2015; LatestRevisionDate: 03.03.2015
C164 = CC0201_100NF_6.3V_10%_X5R: as C297 on sheet USB_Serial_Quad; Part Number: CC0201_100NF_6.3V_10%_X5R; Component Kind: Standard; Component Type: Standard; Pin Count: 2; Value: 100nF; Status: Not Recommended; Manufacturer Part Number: CC0201_100NF_6.3V_10%_X5R; Case: 0201; Mounted: Yes; Socket: No; SMD: Yes; Sense: No; Manufacturer1 Example: AVX; Manufacturer1 ComponentHeight: 0.33mm; HelpURL: \\cern.ch\dfs\Applications\Altium\Datasheets\CC0201_X5R_AVX.pdf; Author: CERN DEM JLC; CreateDate: 03.12.2007; LatestRevisionDate: 03.12.2007
FB6 = IND0603_MURATA_BLM18SG221TN1: as FB18-FB24 on sheet DIFF_DELAY_FANOUT; Part Number: IND0603_MURATA_BLM18SG221TN1; Component Kind: Standard; Component Type: Standard; Pin Count: 2; Value: 220R@100MHz; Manufacturer Part Number: BLM18SG221TN1; Case: 0603; Mounted: Yes; Socket: No; SMD: Yes; Sense: No; ComponentHeight: 0.95mm; HelpURL: \\cern.ch\dfs\Applications\Altium\Datasheets\IND0603_MURATA_BLM18S.pdf; Author: CERN DEM MR; CreateDate: 08.01.2016; LatestRevisionDate: 25.10.2018
R55 R56 = R0402_120R_1%_0.0625W_100PPM: Resistor - 1%; Part Description: General Purpose Thick Film Chip Resistor; Manufacturer: GENERIC; Manufacturer1 Part Number: 232270671201L; TC: ±100ppm/°C; PressFit: No; Part Number: R0402_120R_1%_0.0625W_100PPM; Component Kind: Standard; Component Type: Standard; Pin Count: 2; Value: 120; Status: Not Recommended; Power: 0.0625W; Manufacturer Part Number: R0402_120R_1%_0.0625W_100PPM; Case: 0402; Mounted: Yes; Sense: No; Socket: No; SMD: Yes; Manufacturer1 Example: YAGEO PHYCOMP; Manufacturer1 ComponentHeight: 0.4mm; HelpURL: \\cern.ch\dfs\Applications\Altium\Datasheets\R0402_Phycomp_RC0402.pdf; Author: CERN DEM JLC; CreateDate: 03.12.2007; LatestRevisionDate: 17.10.2012
Y2 = OSC_125MHZ_SI-TIME_SIT9121AI-2C2-33E125.000000: Standard Frequency Differential Oscillator; Part Description: 3.3V, ±25ppm, -40..85°C, 3.2x5.0mm Surface Mount LVDS High Performance Differential Oscillator (SIT9121 Series); Manufacturer: SI TIME; PressFit: No; Bonding: No; Part Number: OSC_125MHZ_SI-TIME_SIT9121AI-2C2-33E125.000000; Component Kind: Standard; Component Type: Standard; PackageDescription: SiT9121 Series Package C, Oscillators, Version 3.2.0mm x 5.0mm, Pitch 1.27mm; 6 Pin; Value: 125MHz; Manufacturer Part Number: SIT9121AI-2C2-33E125.000000; Pin Count: 6; Mounted: Yes; Socket: No; SMD: Yes; Sense: No; ComponentHeight: 0.8mm; HelpURL: \\cern.ch\dfs\Applications\Altium\Datasheets\OSC_SI-TIME_SIT9121.pdf; Author: CERN DEM HF; CreateDate: 06.12.2024; LatestRevisionDate: 06.12.2024